# EAGLE design ShieldClon_0_00 (EAGLE 6.5.0)
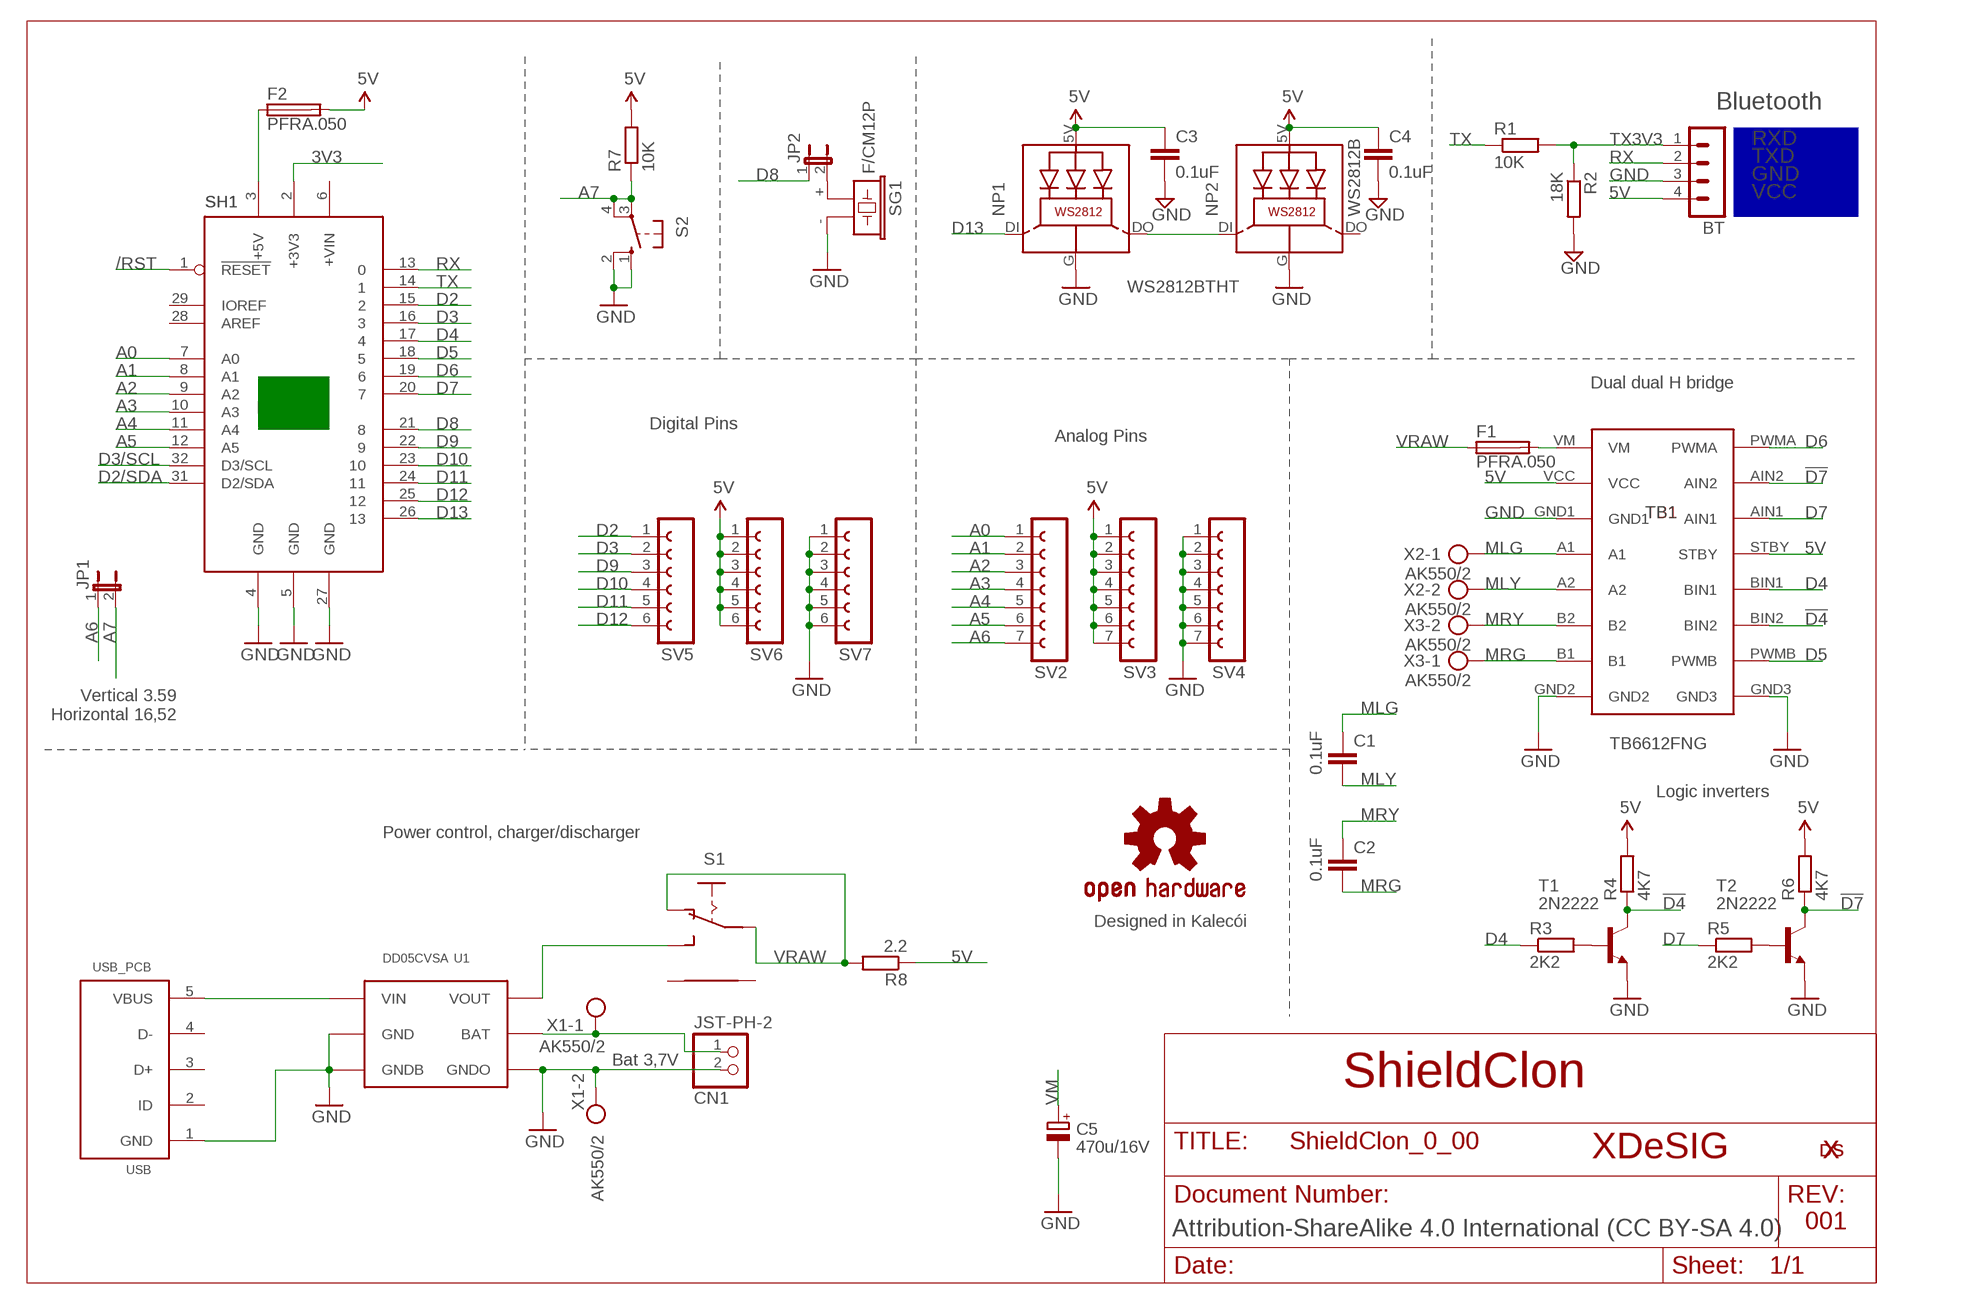
[diagram p0: schematic, sheet 1]

## Parts
BT  MA04-1  [MA04-1]
C1  0.1uF  C-EU050-024X044  [C050-024X044]
C2  0.1uF  C-EU050-024X044  [C050-024X044]
C3  0.1uF  C-EU050-024X044  [C050-024X044]
C4  0.1uF  C-EU050-024X044  [C050-024X044]
C5  470u/16V  CPOL-EUE2.5-7  [E2,5-7]
CN1  JST-PH-2  JST_2PIN-THM-RA  [JST-PH-2-THM-RA]
F1  PFRA.050  FUSETE5  [TE5]
F2  PFRA.050  FUSETE5  [TE5]
JP1  JP1E  [JP1]
JP2  JUMPER_JP1E  [JUMPER_JP1]
LOGO4  OSHW-LOGOS  [OSHW-LOGO-S]
NP1  WS2812BTHT  [NEOPIXEL5MM]
NP2  WS2812B  WS2812BTHT  [NEOPIXEL5MM]
R1  10K  R-EU_0204/7  [0204/7]
R2  18K  R-EU_0204/7  [0204/7]
R3  2K2  R-EU_0204/7  [0204/7]
R4  4K7  R-EU_0204/7  [0204/7]
R5  2K2  R-EU_0204/7  [0204/7]
R6  4K7  R-EU_0204/7  [0204/7]
R7  10K  R-EU_0204/7  [0204/7]
R8  2.2  R-EU_0204/7  [0204/7]
S1  ESCORNA_SK12F14D  [ESCORNA_SK-12D07]
S2  10-XX  [B3F-10XX]
SG1  F/CM12P  [F/CM12P]
SH1  ARDUINO_LEONARDO  [LEONARDO]
SV2  FE07-1  [FE07]
SV3  FE07-1  [FE07]
SV4  FE07-1  [FE07]
SV5  FE06-1  [FE06]
SV6  FE06-1  [FE06]
SV7  FE06-1  [FE06]
T1  2N2222  [TO92-EBC-OVAL]
T2  2N2222  [TO92-EBC-OVAL]
TB1  TB6612FNG  [TB6612FNG]
U1  DD05CVSA  [DD05CVSA]
U$18  XDESIG21  [XDESIG]
U$19  XDESIG5MM  [XDESIG_CU]
USB  USB_PCB  [USB_PCB]
X1  AK550/2  [AK550/2]
X2  AK550/2  [AK550/2]
X3  AK550/2  [AK550/2]

## Nets
3V3: SH1.2(+3V3)
5V: BT.4 C3.1 C4.1 F2.2 NP1.5V(LEDVDD) NP2.5V(LEDVDD) R4.2 R6.2 R7.2 R8.1 SV3.1 SV3.2 SV3.3 SV3.4 SV3.5 SV3.6 SV3.7 SV6.1 SV6.2 SV6.3 SV6.4 SV6.5 SV6.6 TB1.STBY TB1.VCC
!D4: R4.1 T1.C TB1.BIN2
!D7: R6.1 T2.C TB1.AIN2
/RST: SH1.1(!RESET)
A0: SH1.7(A0) SV2.1
A1: SH1.8(A1) SV2.2
A2: SH1.9(A2) SV2.3
A3: SH1.10(A3) SV2.4
A4: SH1.11(A4) SV2.5
A5: SH1.12(A5) SV2.6
A6: JP1.1 SV2.7
A7: JP1.2 R7.1 S2.3(P) S2.4(P1)
D2: SH1.15 SV5.1
D2/SDA: SH1.31(D2/SDA)
D3: SH1.16 SV5.2
D3/SCL: SH1.32(D3/SCL)
D4: R3.1 SH1.17 TB1.BIN1
D5: SH1.18 TB1.PWMB
D6: SH1.19 TB1.PWMA
D7: R5.1 SH1.20 TB1.AIN1
D8: JP2.1 SH1.21
D9: SH1.22 SV5.3
D10: SH1.23 SV5.4
D11: SH1.24 SV5.5
D12: SH1.25 SV5.6
D13: NP1.DI SH1.26
GND: BT.3 C3.2 C4.2 C5.- CN1.2 NP1.G(GND) NP2.G(GND) R2.2 S2.1(S) S2.2(S1) SG1.- SH1.4(GND) SH1.5(GND) SH1.27(GND) SV4.1 SV4.2 SV4.3 SV4.4 SV4.5 SV4.6 SV4.7 SV7.1 SV7.2 SV7.3 SV7.4 SV7.5 SV7.6 T1.E T2.E TB1.GND1 TB1.GND2 TB1.GND3 U1.P$2(GND) U1.P$4(GNDB) U1.P$5(GNDO) USB.1(GND) X1.2
MLG: C1.1 TB1.A1 X2.1
MLY: C1.2 TB1.A2 X2.2
MRG: C2.2 TB1.B1 X3.1
MRY: C2.1 TB1.B2 X3.2
N$1: R3.2 T1.B
N$2: JP2.2 SG1.+
N$3: F2.1 SH1.3(+5V)
N$4: R5.2 T2.B
N$5: U1.P$1(VIN) USB.5(VBUS)
N$8: CN1.1 U1.P$3(BAT) X1.1
N$9: NP1.DO NP2.DI
N$14: S1.P$3(S) U1.P$6(VOUT)
RX: BT.2 SH1.13
TX: R1.1 SH1.14
TX3V3: BT.1 R1.2 R2.1
VM: C5.+ F1.2 TB1.VM
VRAW: F1.1 R8.2 S1.P$1(P) S1.P$2(O)
Unconnected: NP2.DO S1.P$4 S1.P$5 SH1.6(+VIN) SH1.28(AREF) SH1.29(IOREF) USB.2(ID) USB.3(D+) USB.4(D-)

## Notes on the sheet
- Bluetooth
- RXD
- TXD
- GND
- VCC
- Dual dual H bridge
- Digital Pins | Analog Pins
- Vertical 3.59
  Horizontal 16,52
- Logic inverters
- Power control, charger/discharger
- Designed in Kalecói
- Bat 3,7V
- ShieldClon
- XDeSIG
- 001
- Attribution-ShareAlike 4.0 International (CC BY-SA 4.0)

## Library data of the parts
BT = con-lstb:MA04-1: PIN HEADER; OC_FARNELL: unknown; OC_NEWARK: unknown
C1-C4 = rcl:C-EU: CAPACITOR, European symbol
C5 = rcl:CPOL-EU: POLARIZED CAPACITOR, European symbol
CN1 = adafruit:JST_2PIN: JST 2-Pin Connectors of various flavors SMT-RA (S2B-PH-SM4) 4UConnector #17311 SMT (B2B-PH-SM4) THM-RA (S2B-PH) THM (B2B-PH)
F1 F2 = fuse:FUSE: Fuse; OC_FARNELL: unknown; OC_NEWARK: unknown
JP1 = jumper:JP1E: JUMPER
JP2 = cervus2.100:JUMPER_JP1E: JUMPER
LOGO4 = SparkFun-Aesthetics:OSHW-LOGO: Open Source Hardware Logo This logo indicates the piece of hardware it is found on incorporates a OSHW license and/or adheres to the definition of open source hardware found here: http://freedomdefined.org/OSHW
NP1 NP2 = adafruit:WS2812B
R1-R8 = rcl:R-EU_: RESISTOR, European symbol
S1 = Escorna_CPU_2_01:ESCORNA_SK12F14
S2 = switch-omron:10-XX: OMRON SWITCH; MPN: B3F-1000; OC_FARNELL: 176432; OC_NEWARK: 36M3542
SG1 = buzzer:F/CM12P: BUZZER Source: Buerklin; OC_FARNELL: unknown; OC_NEWARK: unknown
SH1 = arduino:ARDUINO_LEONARDO: SHIELD FOR ARDUINO LEONARDO DRAW BY Xabier Rosas
SV2-SV4 = con-lsta:FE07-1: FEMALE HEADER; OC_FARNELL: unknown; OC_NEWARK: unknown
SV5-SV7 = con-lsta:FE06-1: FEMALE HEADER; OC_FARNELL: unknown; OC_NEWARK: unknown
T1 T2 = adafruit:2N2222: NPN TRANSISTOR Big oval pads
TB1 = mClonShield_000:TB6612FNG
U1 = escorna_LBREscorna_CPU_2_10:DD05CVSA
U$18 U$19 = xdesig:XDESIG
USB = escorna_LBREscorna_CPU_2_10:USB_PCB
X1-X3 = con-ptr500:AK550/2: CONNECTOR; OC_FARNELL: unknown; OC_NEWARK: unknown

## Net classes
0 default: width 0.254 mm, drill 0.61 mm, clearance 0.254 mm
1 power: width 0.254 mm, drill 0.61 mm, clearance 0.254 mm

## Board
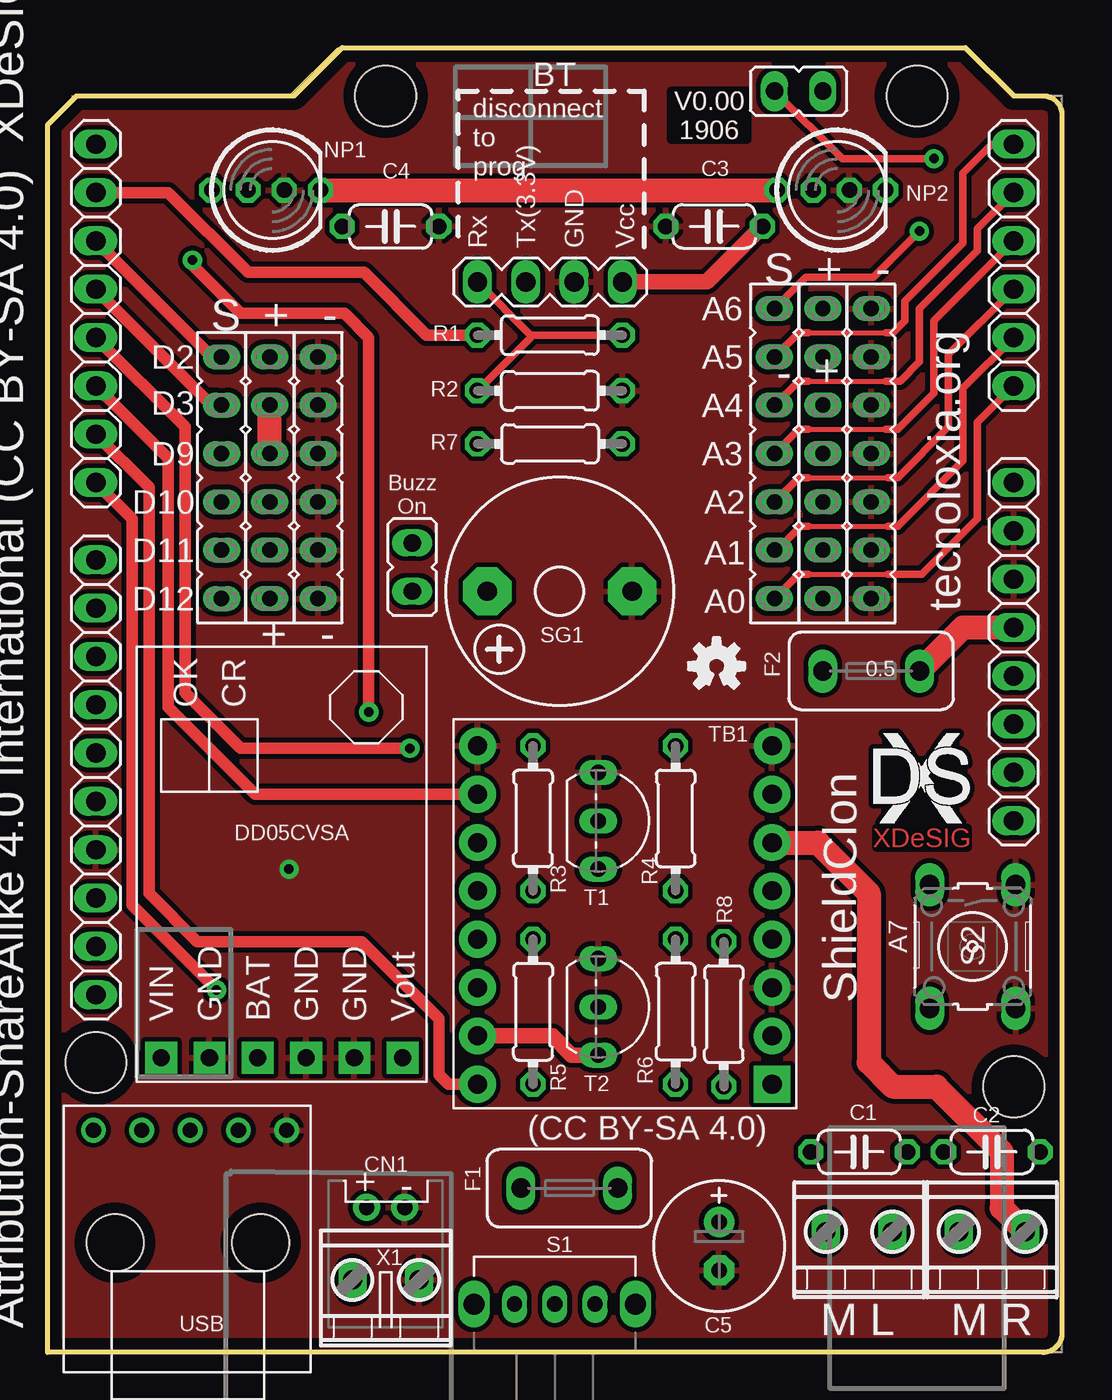
[diagram p1: board, top side]
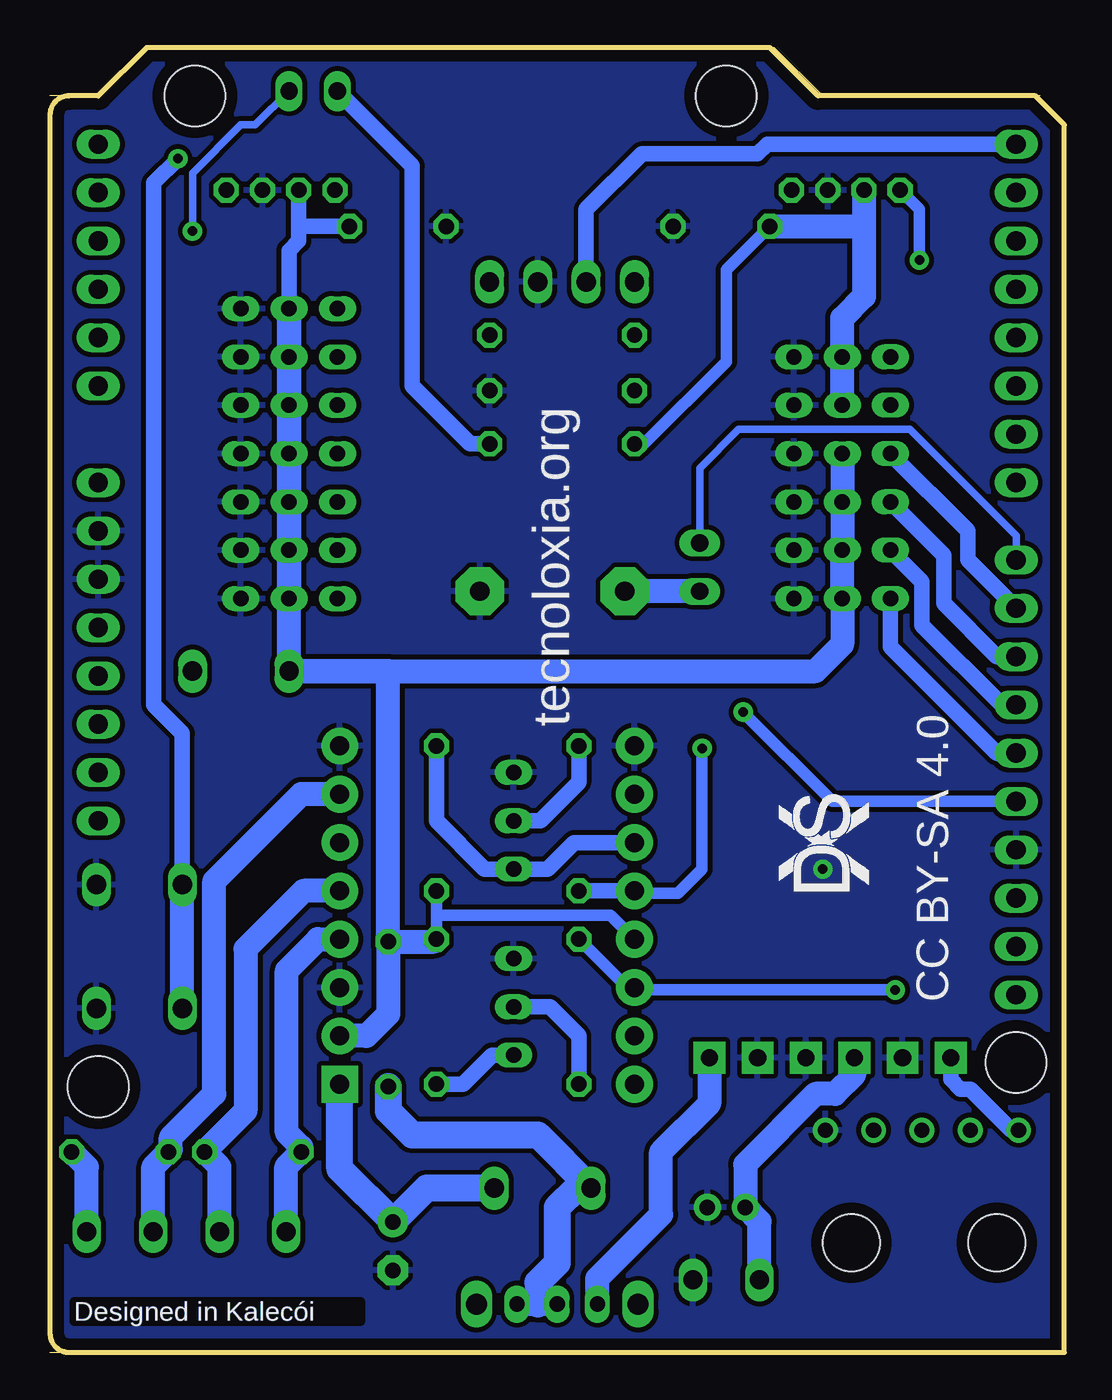
[diagram p2: board, bottom side, seen from below]

Size 53.34 x 68.58 mm. Coordinates in mm from the lower left corner, seen from the top.
Outline: 1.27,66.04 12.7,66.04 15.24,68.58 48.26,68.58
Outline: 50.8,66.04 53.34,66.04
Outline: 53.34,0 0,0
Outline: 48.26,68.58 15.49,68.58 12.95,66.04 1.52,66.04 0,64.52 0,0
Outline: 48.26,68.58 50.8,66.04
Outline: 50.8,66.04 52.34,66.04 arc-90 53.34,65.04 53.34,1 arc-90 52.34,0 0,0
Copper layers (1*16): Top 0.035mm / dielectric 1.5mm / Bottom 0.035mm
Design rules "default": minimum track width 10mil, minimum drill 22mil, track to track 10mil, track to pad 10mil, pad to pad 8mil, via to via 12mil, smd to smd 8mil, copper to edge 24mil, drill to drill 12mil, minimum pad ring 10mil, minimum via ring 10mil, stop-mask expansion 2mil, vias tented up to drill 30mil, thermal gap 10mil
Holes 3.2 mm at 17.78,66.04 45.72,66.04 2.54,15.24 50.8,13.97

### Footprints (pad centres in the part's own frame; a part is rotated, then mirrored left to right if it is on the bottom)
MA04-1 = drill 1.016 long: 1 -3.81,0; 2 -1.27,0; 3 1.27,0; 4 3.81,0
C050-024X044 = drill 0.813 octagon: 1 -2.54,0; 2 2.54,0
E2,5-7 = drill 0.813 pad 1.6: + -1.27,0 | drill 0.813 pad 1.6 octagon: - 1.27,0
JST-PH-2-THM-RA = drill 0.8 pad 1.422: 1 1,0; 2 -1,0
TE5 = drill 1.016 long: 1 -2.54,0; 2 2.54,0
JP1 = drill 0.914 long: 1 0,-1.27; 2 0,1.27
JUMPER_JP1 = drill 0.914 long: 1 0,-1.27; 2 0,1.27
NEOPIXEL5MM = drill 0.813 pad 1.27 octagon: 5V -1.27,0; DI -3.175,0; DO 2.54,0; G 0.635,0
0204/7 = drill 0.813 octagon: 1 -3.81,0; 2 3.81,0
ESCORNA_SK-12D07 = drill 0.8 long: P$1 0,0; P$2 2.115,0; P$3 -2.115,0 | drill 1.1 pad 1.422 long: P$4 -4.25,0; P$5 4.25,0
B3F-10XX = drill 1.016 long: 1 -3.251,2.261; 2 3.251,2.261; 3 -3.251,-2.261; 4 3.251,-2.261
F/CM12P = drill 1.016 pad 2.54 octagon: + 3.81,0; - -3.81,0
LEONARDO = drill 1.016 long: 1 -24.13,1.27; 2 -24.13,-1.27; 3 -24.13,-3.81; 4 -24.13,-6.35; 5 -24.13,-8.89; 6 -24.13,-11.43; 7 -24.13,-16.51; 8 -24.13,-19.05; 9 -24.13,-21.59; 10 -24.13,-24.13; 11 -24.13,-26.67; 12 -24.13,-29.21; 13 24.13,-29.21; 14 24.13,-26.67; 15 24.13,-24.13; 16 24.13,-21.59; 17 24.13,-19.05; 18 24.13,-16.51; 19 24.13,-13.97; 20 24.13,-11.43; 21 24.13,-7.366; 22 24.13,-4.826; 23 24.13,-2.286; 24 24.13,0.254; 25 24.13,2.794; 26 24.13,5.334; 27 24.13,7.874; 28 24.13,10.414; 29 -24.13,3.81; 30 -24.13,6.35; 31 24.13,12.954; 32 24.13,15.494 | hole 3.2: 24.13,19.05; 8.89,-31.75; -19.05,-31.75
FE07 = drill 0.813 long: 1 -7.62,0; 2 -5.08,0; 3 -2.54,0; 4 0,0; 5 2.54,0; 6 5.08,0; 7 7.62,0
FE06 = drill 0.813 long: 1 -6.35,0; 2 -3.81,0; 3 -1.27,0; 4 1.27,0; 5 3.81,0; 6 6.35,0
TO92-EBC-OVAL = drill 0.813 long: B 0,-1.27; C 2.54,-1.27; E -2.54,-1.27
TB6612FNG = drill 1 pad 1.93: A1 -7.62,-1.27; A2 -7.62,-3.81; AIN1 7.874,1.27; AIN2 7.874,3.81; B1 -7.62,-8.89; B2 -7.62,-6.35; BIN1 7.874,-3.81; BIN2 7.874,-6.35; GND1 -7.62,1.27; GND2 -7.62,-11.43; GND3 7.874,-11.43; PWMA 7.874,6.35; PWMB 7.874,-8.89; STBY 7.874,-1.27; VCC -7.62,3.81 | drill 1 pad 1.93 square: VM -7.62,6.35
DD05CVSA = drill 0.9 pad 1.676 square: P$1 0,0; P$2 2.54,0; P$3 5.08,0; P$4 7.62,0; P$5 10.16,0; P$6 12.7,0
USB_PCB = drill 0.8: 1 -5.08,-5.08; 2 -2.54,-5.08; 3 0,-5.08; 4 2.54,-5.08; 5 5.08,-5.08 | hole 3: -3.707,0.841; 3.943,0.841
AK550/2 = drill 1 pad 1.5 long: 1 -1.75,0; 2 1.75,0

### Placement (x,y rotation side)
BT  26.42,56.26 0 top
C1  42.67,10.54 0 top
C2  49.66,10.54 180 top
C3  35.05,59.18 180 top
C4  18.03,59.18 0 top
C5  35.31,5.59 270 top
CN1  17.78,7.62 180 top
F1  27.43,8.64 0 top
F2  43.31,35.81 180 top
JP1  39.5,66.29 90 top
JP2  19.18,41.27 180 top
LOGO4  35.18,36.07 0 top
NP1  11.81,61.09 0 top
NP2  41.53,61.09 0 top
R1  26.42,53.47 0 top
R2  26.42,50.55 0 top
R3  25.53,28.07 90 top
R4  33.02,28.07 270 top
R5  25.53,17.91 270 top
R6  33.02,17.91 90 top
R7  26.42,47.75 180 top
R8  35.56,17.78 270 top
S1  26.67,2.54 0 top
S2  48.64,21.34 270 top
SG1  26.92,40.01 180 top
SH1  26.67,34.29 180 top
SV2  38.23,47.24 90 top
SV3  40.77,47.24 90 top
SV4  43.31,47.24 90 top
SV5  9.14,45.97 270 top
SV6  11.68,45.97 90 top
SV7  14.22,45.97 90 top
T1  30.23,27.94 270 top
T2  30.23,18.16 270 top
TB1  30.48,20.45 180 top
U1  5.97,15.49 0 top
U$18  10.29,24.26 90 bottom
U$19  43.43,27.81 0 top
U$21  XDESIG21  [XDESIG]  43.43,27.81 0 top
USB  7.49,6.6 180 top
X1  17.78,3.81 0 top
X2  42.67,6.35 0 top
X3  49.66,6.35 0 top

### Tracks (layer width: path | path; a pad name or v marks a point on that pad's centre or on a via)
5V
  Top 0.813: BT.4 34.67,56.26 C3.1
  Top 1.27: SV6.4 SV6.5
  Bottom 0.61: TB1.STBY 23.88,22.99 33.02,22.99 | R4.2 33.02,22.99 | 33.02,22.99 R6.2 | R7.2 22.1,47.75 17.78,52.07 17.78,56.9 C4.1
  Bottom 0.813: SV3.7 40.77,57.91 40.26,58.42 40.26,59.05 | 40.26,59.05 NP2.5V | C3.1 40.13,59.18 40.26,59.05
  Bottom 1.27: SV3.6 SV3.5 SV3.4 SV3.3 SV3.2 SV3.1 SV3.7 F2.2 | SV6.6 SV6.5 11.68,54.36 10.54,55.5 10.54,58.93 | R8.1 35.56,35.81 F2.2 | R8.1 33.15,21.59 R6.2 | R8.1 35.56,17.78 36.7,16.64 TB1.VCC | F2.2 13.08,35.81 11.68,37.21 SV6.1 SV6.2 SV6.4 SV6.3 | NP1.5V 10.54,58.93 | C4.1 10.79,59.18 10.54,58.93
!D4
  Bottom 0.813: TB1.BIN2 25.78,26.8 27.18,25.4 T1.C 30.48,25.4 33.02,27.94 R4.1
!D7
  Top 0.813: T2.C 27.56,15.62 26.54,16.64 TB1.AIN2
  Bottom 0.813: R6.1 31.62,14.1 30.1,15.62 T2.C
A0
  Top 0.254: 40.01,40.89 44.2,40.89
  Top 0.406: SV2.1 39.5,40.89 40.01,40.89 | SH1.7 48.9,48.9 48.9,43.81 45.97,40.89 44.2,40.89
A1
  Top 0.254: 40.01,43.43 44.2,43.43
  Top 0.406: SV2.2 38.35,42.16 39.62,43.43 40.01,43.43 | 44.2,43.43 44.7,43.43 48.13,46.86 48.13,50.67 SH1.8
A2
  Top 0.254: 40.01,45.97 44.2,45.97
  Top 0.406: SV2.3 39.5,45.97 40.01,45.97 | SH1.9 47.37,52.45 47.37,48.64 44.7,45.97 44.2,45.97
A3
  Top 0.254: 40.01,48.51 44.07,48.51
  Top 0.406: SV2.4 39.5,48.51 40.01,48.51 | SH1.10 46.61,54.23 46.61,50.42 44.7,48.51 44.07,48.51
A4
  Top 0.254: 40.01,51.05 44.07,51.05
  Top 0.406: SV2.5 39.5,51.05 40.01,51.05 | SH1.11 48.9,59.05 48.9,57.91 45.85,54.86 45.85,52.07 44.83,51.05 44.07,51.05
A5
  Top 0.254: 40.01,53.59 44.07,53.59
  Top 0.406: SV2.6 39.5,53.59 40.01,53.59 | 44.07,53.59 44.45,53.59 45.09,54.23 45.09,55.24 48.13,58.29 48.13,61.98 49.66,63.5 SH1.12
A6  (via drill 0.5)
  Top 0.406: SV2.7 39.88,56.52 43.43,56.52 v45.85,58.93
  Bottom 0.406: v45.85,58.93 45.85,61.98 43.31,64.52 42.55,64.52 JP1.1
A7  (via drill 0.5)
  Top 0.406: v46.61,62.74 41.78,62.74 JP1.2
  Bottom 0.61: v46.61,62.74 47.37,61.98
  Bottom 0.813: R7.1 31.24,47.75 34.29,50.8 34.29,62.36 JP1.2 | S2.3 46.38,32.54 47.88,34.04 47.88,61.47 v46.61,62.74
  Bottom 1.27: S2.4 S2.3
D2
  Top 0.61: SV5.1 8.64,52.32 SH1.15
D3
  Top 0.61: SV5.2 8.64,49.78 SH1.16
D4  (via drill 0.5)
  Top 0.61: SH1.17 7.24,48.64 7.24,34.67 10.16,31.75 v19.05,31.75
  Bottom 0.61: TB1.BIN1 22.48,24.13 20.32,24.13 19.05,25.4 v19.05,31.75
  Bottom 0.813: TB1.BIN1 R3.1
D5
  Top 0.61: SH1.18 6.35,46.99 6.35,33.91 10.92,29.34 TB1.PWMB
D6
  Top 0.61: SH1.19 5.33,45.47 5.33,24.13 7.87,21.59 16.51,21.59 20.57,17.53 20.57,14.61 21.08,14.1 TB1.PWMA
D7  (via drill 0.5)
  Top 0.61: SH1.20 4.45,43.81 4.45,23.5 v8.89,19.05
  Bottom 0.61: R5.1 22.99,19.18 TB1.AIN1 22.48,19.05 v8.89,19.05
D8
  Bottom 0.406: SH1.21 2.54,42.93 8.13,48.51 14.99,48.51 15.24,48.51 17.15,48.51 19.18,46.48 JP2.1
D9
  Bottom 0.813: SV5.3 5.08,43.18 5.08,41.66 SH1.22
D10
  Bottom 0.813: SH1.23 3.56,36.58 6.35,39.37 6.35,41.91 SV5.4
D11
  Bottom 0.813: SH1.24 3.3,34.04 7.49,38.23 7.49,40.51 SV5.5
D12
  Bottom 0.813: SH1.25 3.56,31.5 9.14,37.08 SV5.6
D13  (via drill 0.5)
  Top 0.61: v16.89,33.66 16.89,53.34 15.62,54.61 10.16,54.61 7.62,57.15 v7.62,57.4
  Bottom 0.61: SH1.26 12.19,28.96 v16.89,33.66 | v7.62,57.4 7.62,60.07 NP1.DI
GND  (via drill 0.5)
  other vias: 12.7,25.4
  pour Top: 0,0 0,64.77 1.27,66.04 12.7,66.04 15.24,68.58 48.26,68.58 50.8,66.04 53.34,66.04 53.34,0
  pour Bottom: -1.27,-1.27 -1.27,66.04 12.7,66.04 15.24,68.58 48.26,68.58 50.8,66.04 53.34,66.04 53.34,0
MLG
  Bottom 1.27: X2.1 40.92,9.75 C1.1 40.13,10.79 40.89,11.56 40.89,20.07 39.24,21.72 TB1.A1
MLY
  Bottom 1.27: X2.2 44.42,9.75 C1.2 43.05,12.7 43.05,21.21 40.01,24.26 TB1.A2
MRG
  Bottom 1.27: X3.1 47.91,9.75 C2.2 46.99,10.67 46.99,11.3 44.7,13.59 44.7,24.77 40.13,29.34 TB1.B1
MRY
  Top 1.27: TB1.B2 40.51,26.8 43.18,24.13 43.18,15.24 44.45,13.97 46.74,13.97 50.16,10.54 50.16,7.59 X3.2
  Bottom 1.27: X3.2 51.41,9.75 C2.1
N$1
  Bottom 0.813: R3.2 25.53,29.97 27.56,27.94 T1.B
N$2
  Bottom 1.27: JP2.2 SG1.+
N$3
  Top 1.27: SH1.3 48.13,38.1 F2.1
N$4
  Bottom 0.61: 25.4,14.22 R5.2
  Bottom 0.813: T2.B 27.05,18.16 25.53,16.64 R5.2
N$5
  Bottom 0.813: USB.5 2.79,11.68 4.95,13.84 5.46,13.84 5.97,14.35 U1.P$1
N$8
  Bottom 1.27: U1.P$3 11.05,14.61 12.06,13.59 13.08,13.59 16.78,9.89 CN1.1 16.03,6.87 X1.1
N$9
  Top 1.27: NP1.DO NP2.DI
N$14
  Bottom 1.27: U1.P$6 18.67,13.08 21.21,10.54 21.21,7.24 24.55,3.89 S1.P$3
RX
  Bottom 0.813: SH1.13 15.62,63.5 16.13,62.99 22.23,62.99 25.15,60.07 BT.2
TX
  Top 0.61: R1.1 19.94,53.47 16.64,56.77 10.54,56.77 6.35,60.96 SH1.14
TX3V3
  Top 0.406: R2.1 25.4,53.34 25.4,53.47 | R1.2 25.4,53.47 | 25.4,53.47 BT.1
VM
  Bottom 1.422: TB1.VM 38.1,9.65 C5.+ 33.53,8.64 F1.2
VRAW
  Bottom 1.27: S1.P$1 27.69,2.54 S1.P$2
  Bottom 1.422: R8.2 35.56,12.7 34.29,11.43 27.69,11.43 F1.1 25.65,8.64 26.67,7.62 26.67,4.7 27.69,3.68 27.69,2.54

### Text on the board
Top: V0.00 / 1906 | XDeSIG
Bottom: Designed in Kalecói
tPlace: V0.00 / 1906 | disconnect / to / prog | Rx | Tx(3.3V) | GND | Vcc | S | + | - | S | + | - | A6 | D2 | A5 | - | + | D3 | A4 | D9 | A3 | D10 | Buzz / On | A2 | D11 | A1 | D12 | A0 | + | - | tecnoloxia.org | 0.5 | ShieldClon | DD05CVSA | A7 | (CC BY-SA 4.0) | Attribution-ShareAlike 4.0 International (CC BY-SA 4.0) XDeSIG | M L | M R
bPlace: tecnoloxia.org | CC BY-SA 4.0 | Designed in Kalecói